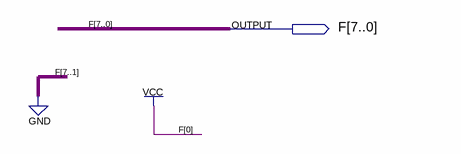
[diagram p0: schematic sheet]
// Quartus schematic outputOne.bdf as structural Verilog: 0 symbols, 1 pins
module outputOne (
  output [7:0] F
);


  assign F = 8'b00000001;
endmodule
